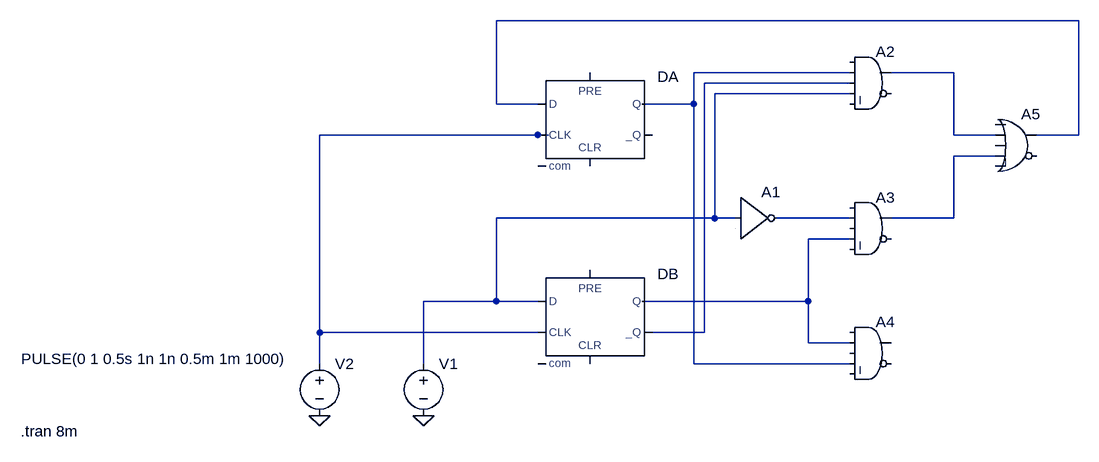
[diagram p0: schematic Q4.asc]
Q4.asc, the LTspice schematic file:
Version 4
SHEET 1 1876 680
WIRE 960 -336 64 -336
WIRE 608 -256 368 -256
WIRE 768 -256 672 -256
WIRE 608 -240 384 -240
WIRE 608 -224 400 -224
WIRE 64 -208 64 -336
WIRE 128 -208 64 -208
WIRE 368 -208 368 -256
WIRE 368 -208 288 -208
WIRE 128 -160 -208 -160
WIRE 144 -160 128 -160
WIRE 768 -160 768 -256
WIRE 832 -160 768 -160
WIRE 960 -160 960 -336
WIRE 960 -160 896 -160
WIRE 832 -128 768 -128
WIRE 400 -32 400 -224
WIRE 400 -32 64 -32
WIRE 432 -32 400 -32
WIRE 608 -32 496 -32
WIRE 768 -32 768 -128
WIRE 768 -32 672 -32
WIRE 608 0 544 0
WIRE 64 96 64 -32
WIRE 64 96 -48 96
WIRE 128 96 64 96
WIRE 544 96 544 0
WIRE 544 96 288 96
WIRE -208 144 -208 -160
WIRE 128 144 -208 144
WIRE 384 144 384 -240
WIRE 384 144 304 144
WIRE 544 160 544 96
WIRE 608 160 544 160
WIRE -208 192 -208 144
WIRE -48 192 -48 96
WIRE 368 192 368 -208
WIRE 608 192 368 192
FLAG -208 272 0
FLAG -48 272 0
SYMBOL Digital\\dflop 208 48 R0
SYMATTR InstName DB
SYMBOL Digital\\dflop 208 -256 R0
SYMATTR InstName DA
SYMBOL Digital\\inv 432 -96 R0
SYMATTR InstName A1
SYMATTR SpiceLine Td=40n
SYMBOL Digital\\and 640 -304 R0
SYMATTR InstName A2
SYMBOL Digital\\and 640 -80 R0
SYMATTR InstName A3
SYMATTR SpiceLine Td=40n
SYMBOL Digital\\and 640 112 R0
SYMATTR InstName A4
SYMATTR SpiceLine Td=40n
SYMBOL Digital\\or 864 -208 R0
SYMATTR InstName A5
SYMATTR SpiceLine Td=40n
SYMBOL voltage -48 176 R0
WINDOW 123 0 0 Left 0
WINDOW 39 0 0 Left 0
SYMATTR InstName V1
SYMATTR Value ""
SYMBOL voltage -208 176 R0
WINDOW 3 -459 9 Left 2
WINDOW 123 0 0 Left 0
WINDOW 39 0 0 Left 0
SYMATTR InstName V2
SYMATTR Value PULSE(0 1 0.5s 1n 1n 0.5m 1m 1000)
TEXT -668 296 Left 2 !.tran 8m

The netlist it stands for:
* Q4.asc
A§DB N005 0 N006 0 0 N004 N009 0 DFLOP
A§DA N001 0 N006 0 0 0 N002 0 DFLOP
A1 N005 0 0 0 0 N008 0 0 BUF Td=40n
A2 0 N002 N004 N005 0 0 N003 0 AND
A3 0 N008 0 N009 0 0 N007 0 AND Td=40n
A4 0 N009 0 N002 0 0 0 0 AND Td=40n
A5 0 N003 0 N007 0 0 N001 0 OR Td=40n
V1 N005 0
V2 N006 0 PULSE(0 1 0.5s 1n 1n 0.5m 1m 1000)
.tran 8m
.backanno
.end